# EAGLE design bluetooth BM20 part (EAGLE 9.6.2)
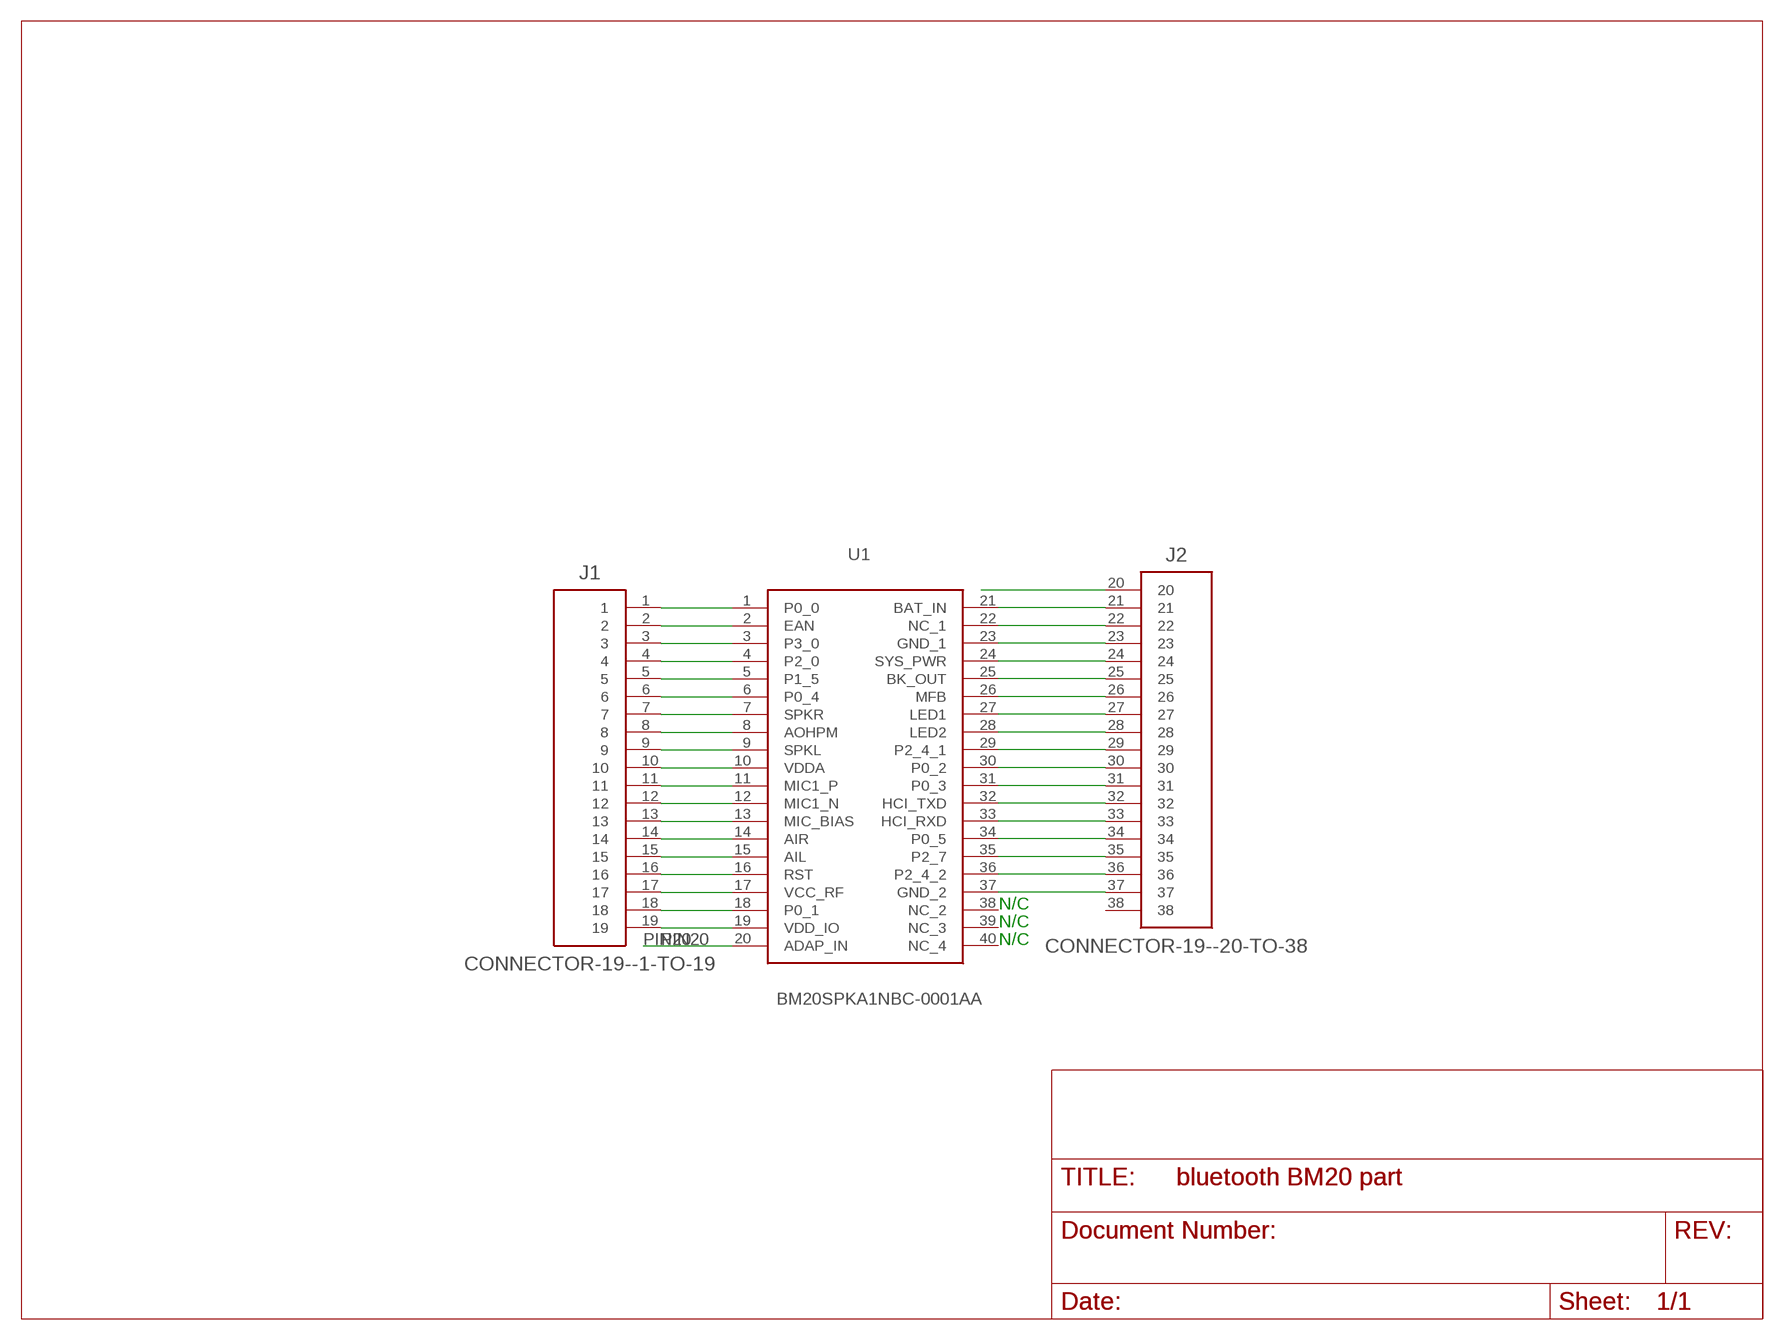
[diagram p0: schematic, sheet 1]

## Parts
J1  CONNECTOR-19--1-TO-19  [ESQ-119-XX-XX-S]
J2  CONNECTOR-19--20-TO-38  [ESQ-119-XX-XX-S--PIN-1-ROUND]
U1  BM20SPKA1NBC-0001AA  [BM20SPKA1NBC0001AA]

## Nets
N$1: J1.4 U1.4(P2_0)
N$2: J1.1 U1.1(P0_0)
N$3: J1.5 U1.5(P1_5)
N$4: J1.2 U1.2(EAN)
N$5: J1.6 U1.6(P0_4)
N$6: J1.3 U1.3(P3_0)
N$7: J1.7 U1.7(SPKR)
N$8: J1.8 U1.8(AOHPM)
N$9: J1.9 U1.9(SPKL)
N$10: J1.10 U1.10(VDDA)
N$11: J1.11 U1.11(MIC1_P)
N$12: J1.12 U1.12(MIC1_N)
N$13: J1.13 U1.13(MIC_BIAS)
N$14: J1.14 U1.14(AIR)
N$15: J1.15 U1.15(AIL)
N$16: J1.16 U1.16(RST)
N$17: J1.17 U1.17(VCC_RF)
N$18: J1.18 U1.18(P0_1)
N$19: J1.19 U1.19(VDD_IO)
N$20: J2.23 U1.23(GND_1)
N$21: J2.24 U1.24(SYS_PWR)
N$22: J2.21 U1.21(BAT_IN)
N$23: J2.25 U1.25(BK_OUT)
N$24: J2.22 U1.22(NC_1)
N$25: J2.26 U1.26(MFB)
N$26: J2.27 U1.27(LED1)
N$27: J2.28 U1.28(LED2)
N$28: J2.29 U1.29(P2_4_1)
N$29: J2.30 U1.30(P0_2)
N$30: J2.31 U1.31(P0_3)
N$31: J2.32 U1.32(HCI_TXD)
N$32: J2.33 U1.33(HCI_RXD)
N$33: J2.34 U1.34(P0_5)
N$34: J2.35 U1.35(P2_7)
N$35: J2.36 U1.36(P2_4_2)
N$36: J2.37 U1.37(GND_2)
PIN20: J2.20 U1.20(ADAP_IN)
Unconnected: J2.38 U1.38(NC_2) U1.39(NC_3) U1.40(NC_4)

## Notes on the sheet
- N/C
- N/C
- N/C

## Library data of the parts
J1 = eagle-library-engr-245-s22:CONNECTOR-19--1-TO-19
J2 = eagle-library-engr-245-s22:CONNECTOR-19--20-TO-38
U1 = eagle-library-engr-245-s22:BM20SPKA1NBC-0001AA: Bluetooth Modules (802.15.1) BT 4.1 Stereo Audio No-Shield/Antenna Source: Datasheet <https://componentsearchengine.com/Datasheets/1/BM20SPKA1NBC-0001AA.pdf>; DESCRIPTION: Bluetooth Modules (802.15.1) BT 4.1 Stereo Audio No-Shield/Antenna; HEIGHT: 2.5mm; MANUFACTURER_NAME: Microchip; MANUFACTURER_PART_NUMBER: BM20SPKA1NBC-0001AA; MOUSER_PART_NUMBER: 579-SPKA1NBC-0001AA; MOUSER_PRICE-STOCK: https://www.mouser.co.uk/ProductDetail/Microchip-Technology/BM20SPKA1NBC-0001AA?qs=uus7iwvxYD8HqvnWsd76VQ%3D%3D

## Board
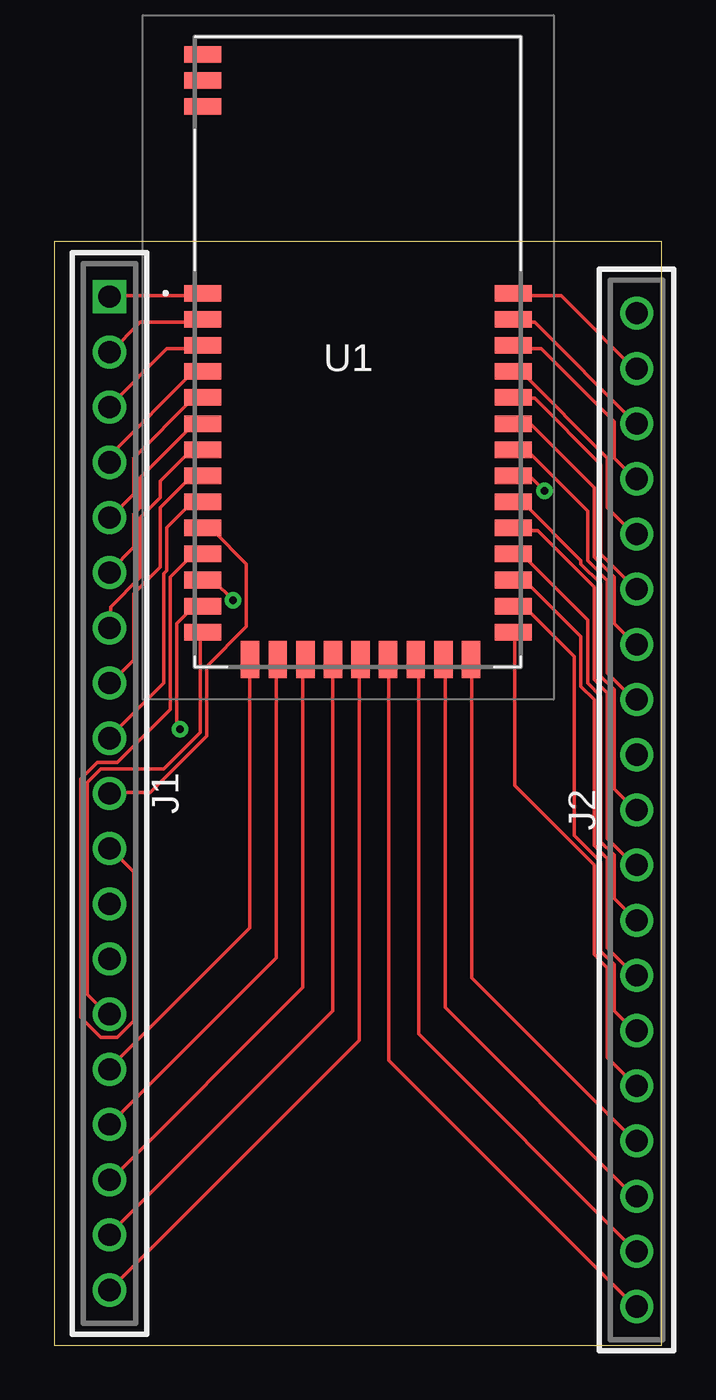
[diagram p1: board, top side]
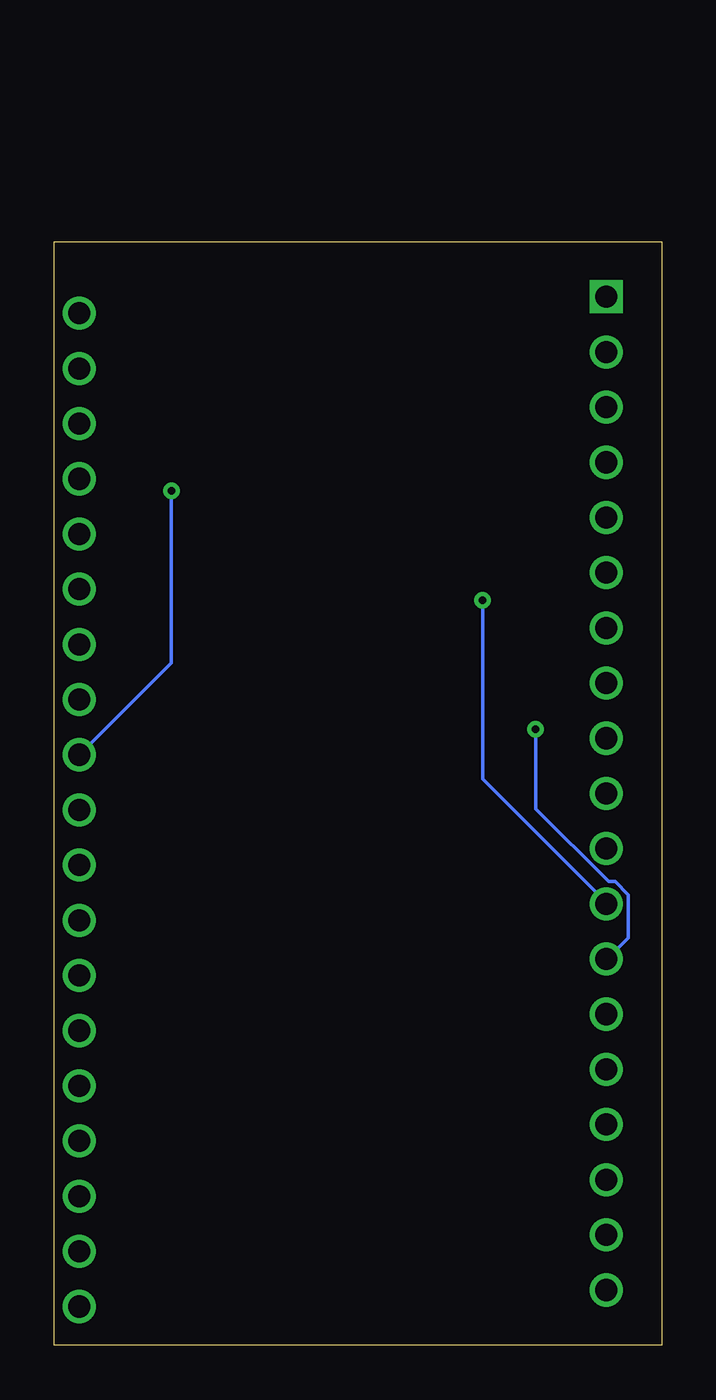
[diagram p2: board, bottom side, seen from below]

Size 27.94 x 50.8 mm. Coordinates in mm from the lower left corner, seen from the top.
Outline: 0,0 27.94,0 27.94,50.8 0,50.8 0,0
Copper layers (1*16): Top 0.035mm / dielectric 1.5mm / Bottom 0.035mm
Design rules "default": minimum track width 6mil, minimum drill 0.35mm, track to track 6mil, track to pad 6mil, pad to pad 6mil, via to via 6mil, smd to smd 6mil, copper to edge 40mil, drill to drill 6mil, minimum pad ring 10mil, minimum via ring 8mil, stop-mask expansion 4mil, vias tented up to drill 0mil, thermal gap 10mil

### Footprints (pad centres in the part's own frame; a part is rotated, then mirrored left to right if it is on the bottom)
ESQ-119-XX-XX-S = drill 1.016 pad 1.524 square: 1 0,0 | drill 1.016 pad 1.524: 2 2.54,0; 3 5.08,0; 4 7.62,0; 5 10.16,0; 6 12.7,0; 7 15.24,0; 8 17.78,0; 9 20.32,0; 10 22.86,0; 11 25.4,0; 12 27.94,0; 13 30.48,0; 14 33.02,0; 15 35.56,0; 16 38.1,0; 17 40.64,0; 18 43.18,0; 19 45.72,0
ESQ-119-XX-XX-S--PIN-1-ROUND = drill 1.016 pad 1.524: 20 -22.86,0; 21 -20.32,0; 22 -17.78,0; 23 -15.24,0; 24 -12.7,0; 25 -10.16,0; 26 -7.62,0; 27 -5.08,0; 28 -2.54,0; 29 0,0; 30 2.54,0; 31 5.08,0; 32 7.62,0; 33 10.16,0; 34 12.7,0; 35 15.24,0; 36 17.78,0; 37 20.32,0; 38 22.86,0
BM20SPKA1NBC0001AA = smd 1.7 x 0.76: 1 -7.15,2.7; 2 -7.15,1.5; 3 -7.15,0.3; 4 -7.15,-0.9; 5 -7.15,-2.1; 6 -7.15,-3.3; 7 -7.15,-4.5; 8 -7.15,-5.7; 9 -7.15,-6.9; 10 -7.15,-8.1; 11 -7.15,-9.3; 12 -7.15,-10.5; 13 -7.15,-11.7; 14 -7.15,-12.9; 24 7.15,-12.9; 25 7.15,-11.7; 26 7.15,-10.5; 27 7.15,-9.3; 28 7.15,-8.1; 29 7.15,-6.9; 30 7.15,-5.7; 31 7.15,-4.5; 32 7.15,-3.3; 33 7.15,-2.1; 34 7.15,-0.9; 35 7.15,0.3; 36 7.15,1.5; 37 7.15,2.7; 38 -7.15,13.7; 39 -7.15,12.5; 40 -7.15,11.3 | smd 0.85 x 1.7: 15 -4.96,-14.15; 16 -3.69,-14.15; 17 -2.42,-14.15; 18 -1.15,-14.15; 19 0.12,-14.15; 20 1.39,-14.15; 21 2.66,-14.15; 22 3.93,-14.15; 23 5.2,-14.15

### Placement (x,y rotation side)
J1  2.54,48.26 270 top
J2  26.8,24.64 90 top
U1  13.97,45.72 0 top

### Tracks (layer width: path | path; a pad name or v marks a point on that pad's centre or on a via)
N$1
  Top 0.152: U1.4 6.71,44.81 6.4,44.81 2.59,41 2.59,40.69 J1.4
N$2
  Top 0.152: U1.1 6.71,48.31 2.59,48.31 J1.1
N$3
  Top 0.152: U1.5 6.71,43.59 6.4,43.59 3.66,40.84 3.66,39.17 2.59,38.1 J1.5
N$4
  Top 0.152: U1.2 6.71,47.09 3.96,47.09 2.59,45.72 J1.2
N$5
  Top 0.152: U1.6 6.71,42.37 6.4,42.37 3.96,39.93 3.96,38.56 3.66,38.25 3.66,36.73 2.59,35.66 J1.6
N$6
  Top 0.152: U1.3 6.71,45.87 5.18,45.87 2.59,43.28 J1.3
N$7
  Top 0.152: U1.7 6.71,41.15 6.25,41.15 4.88,39.78 4.88,39.01 3.96,38.1 3.96,35.36 2.59,33.98 2.59,33.07 J1.7
N$8
  Top 0.152: U1.8 6.71,39.93 6.25,39.93 4.88,38.56 4.88,35.81 3.66,34.59 3.66,31.55 2.59,30.48 J1.8
N$9
  Top 0.152: U1.9 6.71,38.71 6.25,38.71 5.18,37.64 5.18,35.66 5.03,35.51 5.03,30.48 2.59,28.04 J1.9
N$10
  Top 0.152: U1.10 6.86,37.49 7.32,37.49 8.84,35.97 8.84,33.07 7.01,31.24 7.01,28.04 4.42,25.45 2.59,25.45 J1.10
N$11
  Top 0.152: U1.11 6.71,36.27 6.25,36.27 5.33,35.36 5.33,29.26 2.9,26.82 1.98,26.82 1.22,26.06 1.22,15.09 2.13,14.17 2.9,14.17 3.66,14.94 3.66,21.79 2.59,22.86 J1.11
N$12  (via drill 0.35)
  Top 0.152: v8.23,34.29 7.32,35.2 6.86,35.2 U1.12
  Bottom 0.152: v8.23,34.29 8.23,26.06 2.59,20.42 J1.12
N$13  (via drill 0.35)
  Top 0.152: v5.79,28.35 5.64,28.5 5.64,33.22 6.4,33.98 6.71,33.98 U1.13
  Bottom 0.152: v5.79,28.35 5.79,24.69 2.44,21.34 2.13,21.34 1.52,20.73 1.52,18.75 2.44,17.83 J1.13
N$14
  Top 0.152: U1.14 6.71,32.77 6.71,28.19 5.03,26.52 2.13,26.52 1.52,25.91 1.52,16.15 2.44,15.24 J1.14
N$15
  Top 0.152: U1.15 8.99,31.55 8.99,19.2 2.59,12.8 J1.15
N$16
  Top 0.152: J1.16 10.21,17.83 10.21,31.55 U1.16
N$17
  Top 0.152: U1.17 11.43,31.55 11.43,16.46 2.59,7.62 J1.17
N$18
  Top 0.152: U1.18 12.8,31.55 12.8,15.39 2.59,5.18 J1.18
N$19
  Top 0.152: J1.19 14.02,14.02 14.02,31.55 U1.19
N$20
  Top 0.152: U1.23 19.2,31.55 19.2,16.92 26.67,9.45 J2.23
N$21
  Top 0.152: U1.24 21.18,32.77 21.18,25.76 24.84,22.1 24.84,17.98 25.45,17.37 25.45,13.26 26.67,12.04 J2.24
N$22
  Top 0.152: U1.21 16.76,31.55 16.76,14.33 26.67,4.42 J2.21
N$23
  Top 0.152: U1.25 21.18,33.98 21.64,33.98 23.93,31.7 23.93,23.47 25.15,22.25 25.15,18.14 25.76,17.53 25.76,15.39 26.67,14.48 J2.25
N$24
  Top 0.152: U1.22 17.98,31.55 17.98,15.54 26.67,6.86 J2.22
N$25
  Top 0.152: U1.26 21.18,35.2 21.64,35.2 24.23,32.61 24.23,30.33 24.84,29.72 24.84,23.01 25.45,22.4 25.45,18.29 26.67,17.07 J2.26
N$26
  Top 0.152: U1.27 21.18,36.27 21.64,36.27 24.54,33.38 24.54,30.48 25.15,29.87 25.15,23.16 25.76,22.55 25.76,20.57 26.67,19.66 J2.27
N$27
  Top 0.152: U1.28 21.18,37.49 22.25,37.49 24.84,34.9 24.84,30.63 25.45,30.02 25.45,23.32 26.67,22.1 J2.28
N$28
  Top 0.152: U1.29 21.18,38.71 21.64,38.71 24.23,36.12 24.23,35.97 25.15,35.05 25.15,30.79 25.76,30.18 25.76,25.6 26.67,24.69 J2.29
N$29  (via drill 0.35)
  Top 0.152: v22.55,39.32 21.95,39.93 21.18,39.93 U1.30
  Bottom 0.152: v22.55,39.32 22.55,31.39 26.67,27.28 J2.30
N$30
  Top 0.152: U1.31 21.18,41.15 21.79,41.15 24.54,38.41 24.54,36.12 25.45,35.2 25.45,30.94 26.67,29.72 J2.31
N$31
  Top 0.152: U1.32 21.18,42.37 21.95,42.37 24.84,39.47 24.84,36.27 25.76,35.36 25.76,33.22 26.67,32.31 J2.32
N$32
  Top 0.152: U1.33 21.18,43.59 22.1,43.59 25.15,40.54 25.15,36.42 26.67,34.9 J2.33
N$33
  Top 0.152: U1.34 21.18,44.81 21.49,44.81 25.45,40.84 25.45,38.56 26.67,37.34 J2.34
N$34
  Top 0.152: U1.35 21.18,45.87 22.4,45.87 25.76,42.52 25.76,40.84 26.67,39.93 J2.35
N$35
  Top 0.152: U1.36 21.18,47.09 22.1,47.09 26.67,42.52 J2.36
N$36
  Top 0.152: U1.37 21.18,48.31 23.32,48.31 26.67,44.96 J2.37
PIN20
  Top 0.152: U1.20 15.39,31.55 15.39,13.11 26.67,1.83 J2.20